# EAGLE design motor (EAGLE 4.16)
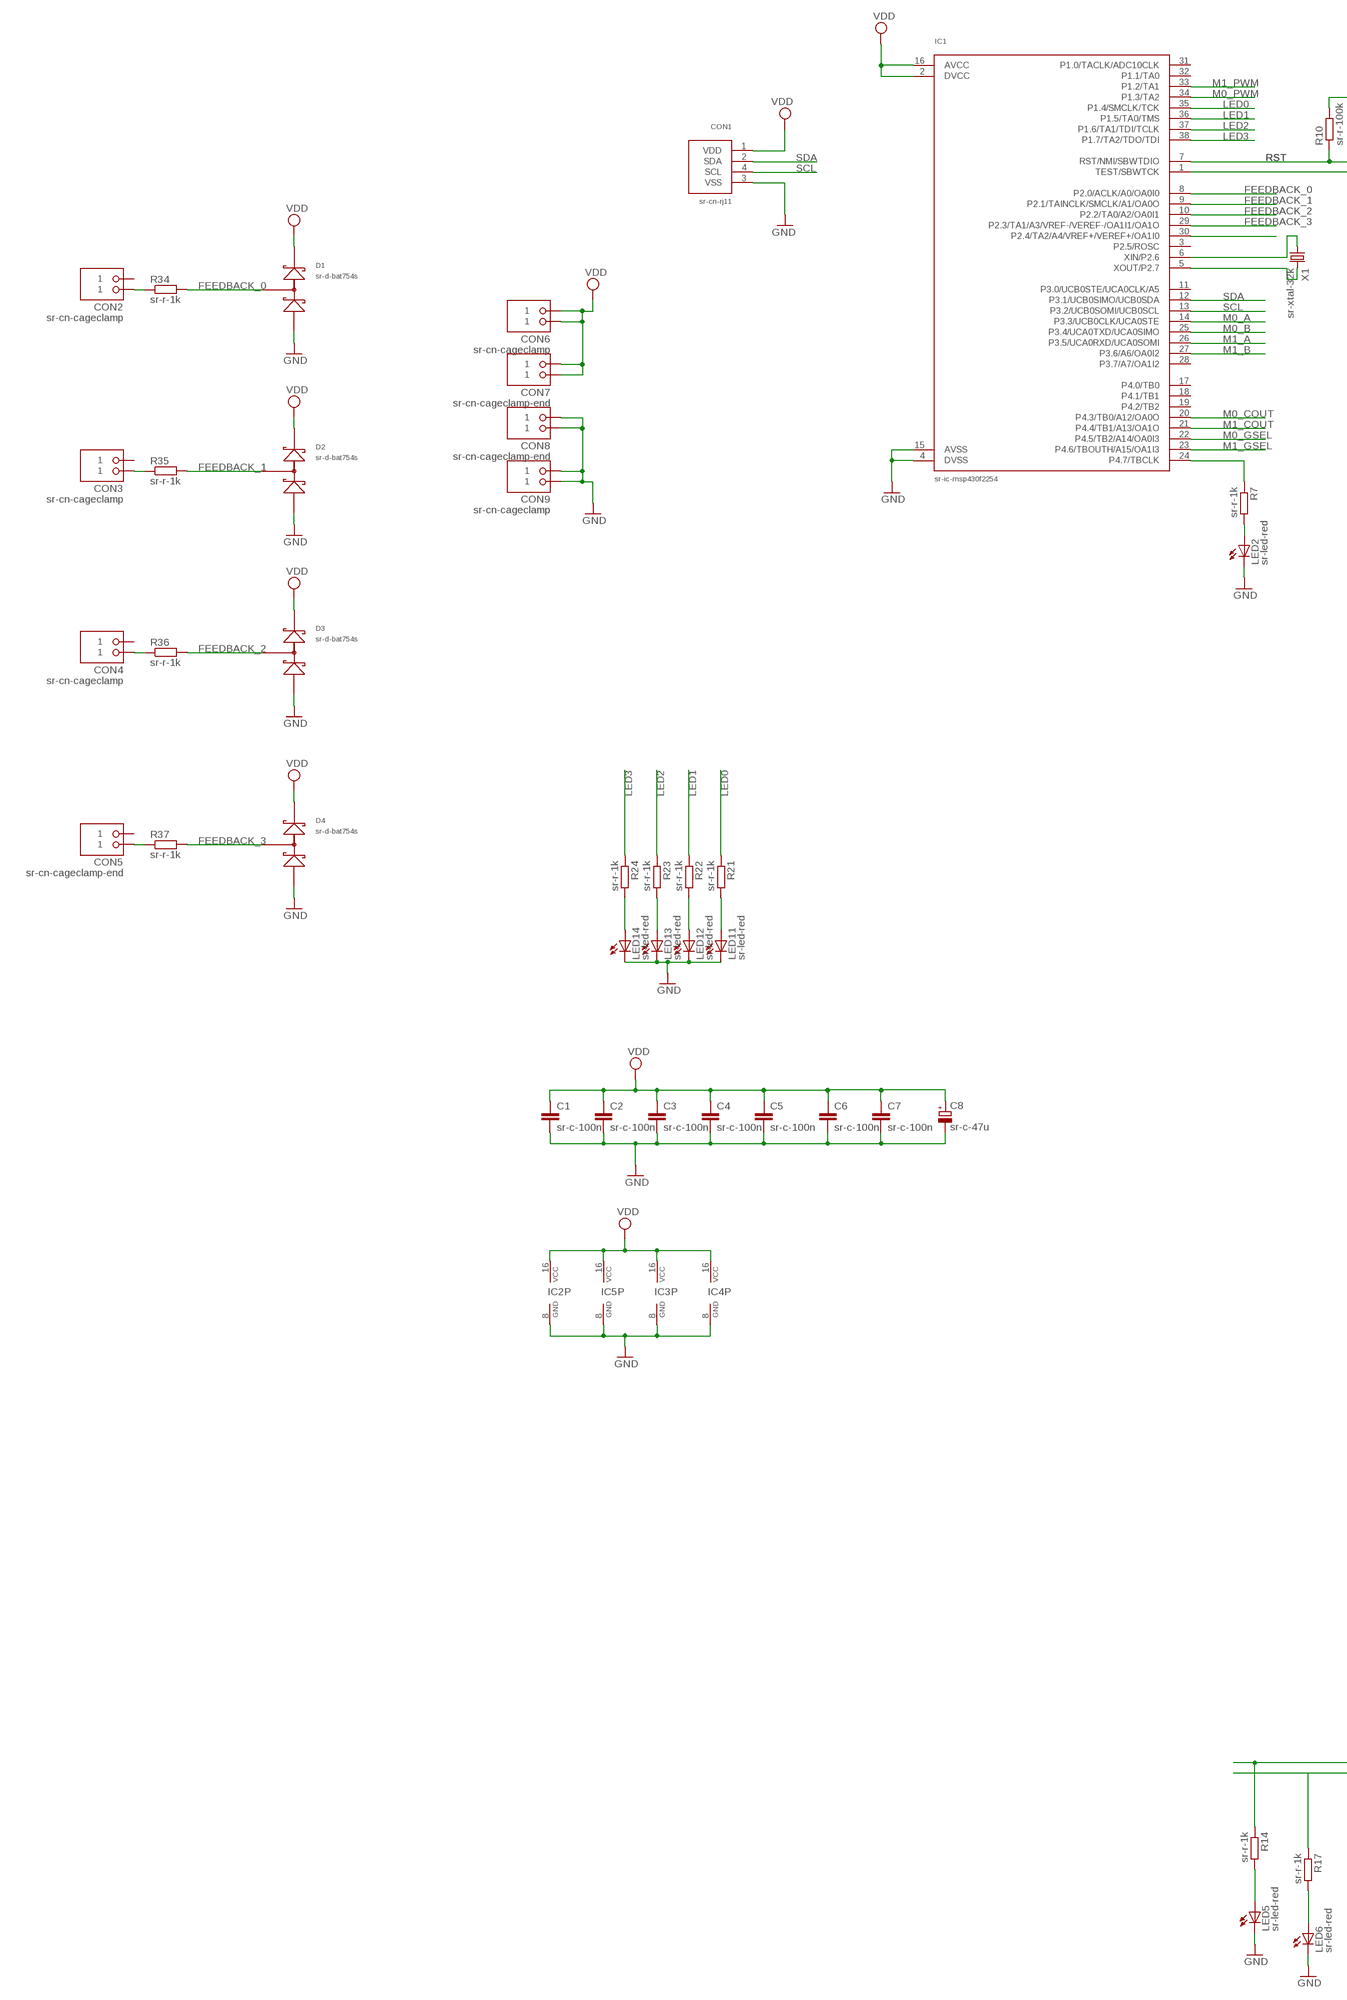
[diagram p0: schematic, sheet 1, part 1 of 2]
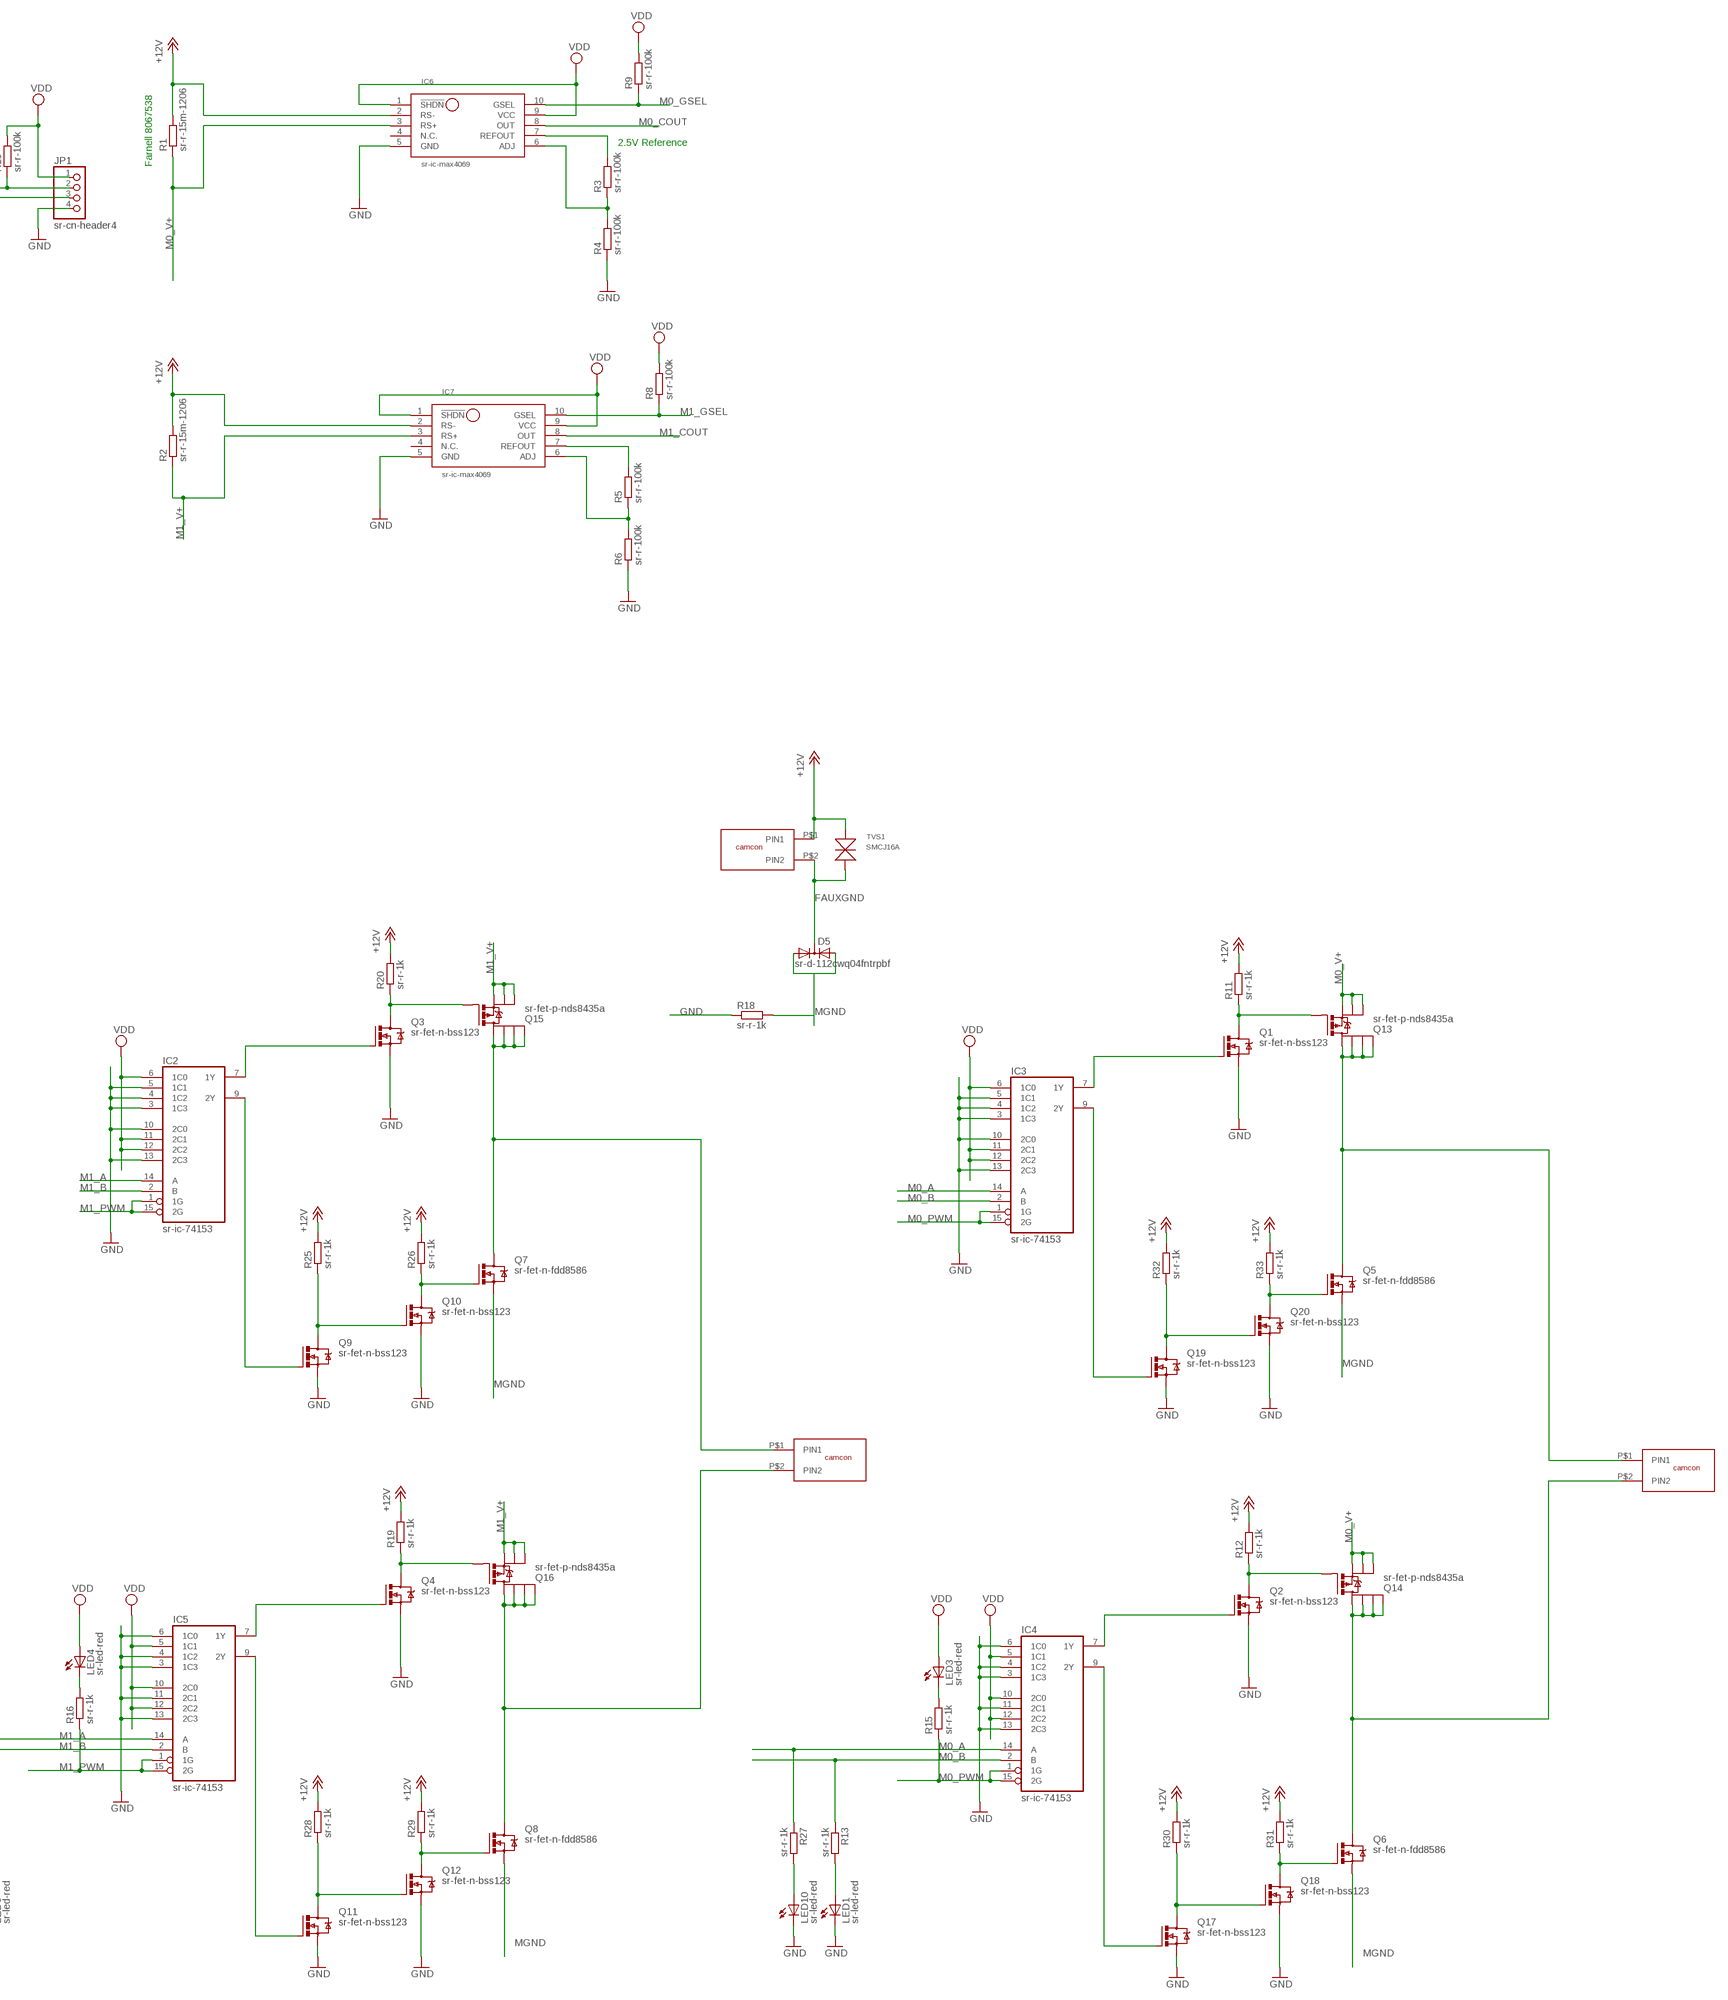
[diagram p1: schematic, sheet 1, part 2 of 2]

## Parts
C1  sr-c-100n  C-0603  [C0603]
C2  sr-c-100n  C-0603  [C0603]
C3  sr-c-100n  C-0603  [C0603]
C4  sr-c-100n  C-0603  [C0603]
C5  sr-c-100n  C-0603  [C0603]
C6  sr-c-100n  C-0603  [C0603]
C7  sr-c-100n  C-0603  [C0603]
C8  sr-c-47u  CPOL-EUE1.8-4  [E1,8-4]
CON1  sr-cn-rj11  MODULE_CON  [RJ11-4P4C]
CON2  sr-cn-cageclamp  CAGECLAMP  [CAGECLAMP]
CON3  sr-cn-cageclamp  CAGECLAMP  [CAGECLAMP]
CON4  sr-cn-cageclamp  CAGECLAMP  [CAGECLAMP]
CON5  sr-cn-cageclamp-end  CAGECLAMP  [CAGECLAMP]
CON6  sr-cn-cageclamp  CAGECLAMP  [CAGECLAMP]
CON7  sr-cn-cageclamp-end  CAGECLAMP  [CAGECLAMP]
CON8  sr-cn-cageclamp-end  CAGECLAMP  [CAGECLAMP]
CON9  sr-cn-cageclamp  CAGECLAMP  [CAGECLAMP]
D1  sr-d-bat754s  BAT754S  [SOT23]
D2  sr-d-bat754s  BAT754S  [SOT23]
D3  sr-d-bat754s  BAT754S  [SOT23]
D4  sr-d-bat754s  BAT754S  [SOT23]
D5  sr-d-112cwq04fntrpbf  FFB20UP20DN-DIODE  [TO252-3]
IC1  sr-ic-msp430f2254  MSP430F2234  [TSSOP38]
IC2  sr-ic-74153  74153NS  [SOP16]
IC3  sr-ic-74153  74153NS  [SOP16]
IC4  sr-ic-74153  74153NS  [SOP16]
IC5  sr-ic-74153  74153NS  [SOP16]
IC6  sr-ic-max4069  MAX4069  [UMAX]
IC7  sr-ic-max4069  MAX4069  [UMAX]
JP1  sr-cn-header4  PINHD-1X4  [1X04]
LED1  sr-led-red  LEDCHIP-LED0603  [CHIP-LED0603]
LED2  sr-led-red  LEDCHIP-LED0603  [CHIP-LED0603]
LED3  sr-led-red  LEDCHIP-LED0603  [CHIP-LED0603]
LED4  sr-led-red  LEDCHIP-LED0603  [CHIP-LED0603]
LED5  sr-led-red  LEDCHIP-LED0603  [CHIP-LED0603]
LED6  sr-led-red  LEDCHIP-LED0603  [CHIP-LED0603]
LED10  sr-led-red  LEDCHIP-LED0603  [CHIP-LED0603]
LED11  sr-led-red  LEDCHIP-LED0603  [CHIP-LED0603]
LED12  sr-led-red  LEDCHIP-LED0603  [CHIP-LED0603]
LED13  sr-led-red  LEDCHIP-LED0603  [CHIP-LED0603]
LED14  sr-led-red  LEDCHIP-LED0603  [CHIP-LED0603]
Q1  sr-fet-n-bss123  2N7002  [SOT23]
Q2  sr-fet-n-bss123  2N7002  [SOT23]
Q3  sr-fet-n-bss123  2N7002  [SOT23]
Q4  sr-fet-n-bss123  2N7002  [SOT23]
Q5  sr-fet-n-fdd8586  FDD8882  [TO252-3]
Q6  sr-fet-n-fdd8586  FDD8882  [TO252-3]
Q7  sr-fet-n-fdd8586  FDD8882  [TO252-3]
Q8  sr-fet-n-fdd8586  FDD8882  [TO252-3]
Q9  sr-fet-n-bss123  2N7002  [SOT23]
Q10  sr-fet-n-bss123  2N7002  [SOT23]
Q11  sr-fet-n-bss123  2N7002  [SOT23]
Q12  sr-fet-n-bss123  2N7002  [SOT23]
Q13  sr-fet-p-nds8435a  NDS8435A  [SO08]
Q14  sr-fet-p-nds8435a  NDS8435A  [SO08]
Q15  sr-fet-p-nds8435a  NDS8435A  [SO08]
Q16  sr-fet-p-nds8435a  NDS8435A  [SO08]
Q17  sr-fet-n-bss123  2N7002  [SOT23]
Q18  sr-fet-n-bss123  2N7002  [SOT23]
Q19  sr-fet-n-bss123  2N7002  [SOT23]
Q20  sr-fet-n-bss123  2N7002  [SOT23]
R1  sr-r-15m-1206  R-EU_M1206  [M1206]
R2  sr-r-15m-1206  R-EU_M1206  [M1206]
R3  sr-r-100k  R-EU_R0603  [R0603]
R4  sr-r-100k  R-EU_R0603  [R0603]
R5  sr-r-100k  R-EU_R0603  [R0603]
R6  sr-r-100k  R-EU_R0603  [R0603]
R7  sr-r-1k  R-EU_R0603  [R0603]
R8  sr-r-100k  R-EU_R0603  [R0603]
R9  sr-r-100k  R-EU_R0603  [R0603]
R10  sr-r-100k  R-EU_R0603  [R0603]
R11  sr-r-1k  R-EU_R0603  [R0603]
R12  sr-r-1k  R-EU_R0603  [R0603]
R13  sr-r-1k  R-EU_R0603  [R0603]
R14  sr-r-1k  R-EU_R0603  [R0603]
R15  sr-r-1k  R-EU_R0603  [R0603]
R16  sr-r-1k  R-EU_R0603  [R0603]
R17  sr-r-1k  R-EU_R0603  [R0603]
R18  sr-r-1k  R-EU_R0603  [R0603]
R19  sr-r-1k  R-EU_R0603  [R0603]
R20  sr-r-1k  R-EU_R0603  [R0603]
R21  sr-r-1k  R-EU_R0603  [R0603]
R22  sr-r-1k  R-EU_R0603  [R0603]
R23  sr-r-1k  R-EU_R0603  [R0603]
R24  sr-r-1k  R-EU_R0603  [R0603]
R25  sr-r-1k  R-EU_R0603  [R0603]
R26  sr-r-1k  R-EU_R0603  [R0603]
R27  sr-r-1k  R-EU_R0603  [R0603]
R28  sr-r-1k  R-EU_R0603  [R0603]
R29  sr-r-1k  R-EU_R0603  [R0603]
R30  sr-r-1k  R-EU_R0603  [R0603]
R31  sr-r-1k  R-EU_R0603  [R0603]
R32  sr-r-1k  R-EU_R0603  [R0603]
R33  sr-r-1k  R-EU_R0603  [R0603]
R34  sr-r-1k  R-EU_R0603  [R0603]
R35  sr-r-1k  R-EU_R0603  [R0603]
R36  sr-r-1k  R-EU_R0603  [R0603]
R37  sr-r-1k  R-EU_R0603  [R0603]
TVS1  SMCJ16A  [DO-214AB]
U$1  sr-cn-camcon2w  CAMCON2W  [09CON2W]
U$2  sr-cn-camcon2w  CAMCON2W  [09CON2W]
U$3  sr-cn-camcon2w  CAMCON2W  [09CON2W]
X1  sr-xtal-32k  CRYSTALTC26H  [TC26H]

## Nets
+12V: IC6.2(RS-) IC7.2(RS-) R1.2 R2.2 R11.2 R12.2 R19.2 R20.2 R25.2 R26.2 R28.2 R29.2 R30.2 R31.2 R32.2 R33.2 TVS1.1 U$3.P$1(PIN1)
FAUXGND: D5.DRAIN(C) TVS1.2 U$3.P$2(PIN2)
FEEDBACK_0: D1.3(MID) IC1.8(P2.0/ACLK/A0/OA0I0) R34.2
FEEDBACK_1: D2.3(MID) IC1.9(P2.1/TAINCLK/SMCLK/A1/OA0O) R35.2
FEEDBACK_2: D3.3(MID) IC1.10(P2.2/TA0/A2/OA0I1) R36.2
FEEDBACK_3: D4.3(MID) IC1.29(P2.3/TA1/A3/VREF-/VEREF-/OA1I1/OA1O) R37.2
GND: C1.2 C2.2 C3.2 C4.2 C5.2 C6.2 C7.2 C8.- CON1.3(VSS) CON8.1 CON8.2 CON9.1 CON9.2 D1.1(ANODE) D2.1(ANODE) D3.1(ANODE) D4.1(ANODE) IC1.4(DVSS) IC1.15(AVSS) IC2.3(1C3) IC2.4(1C2) IC2.5(1C1) IC2.8(GND) IC2.10(2C0) IC2.13(2C3) IC3.3(1C3) IC3.4(1C2) IC3.5(1C1) IC3.8(GND) IC3.10(2C0) IC3.13(2C3) IC4.3(1C3) IC4.4(1C2) IC4.6(1C0) IC4.8(GND) IC4.11(2C1) IC4.13(2C3) IC5.3(1C3) IC5.4(1C2) IC5.6(1C0) IC5.8(GND) IC5.11(2C1) IC5.13(2C3) IC6.5(GND) IC7.5(GND) JP1.4 LED1.C LED2.C LED5.C LED6.C LED10.C LED11.C LED12.C LED13.C LED14.C Q1.2(S) Q2.2(S) Q3.2(S) Q4.2(S) Q9.2(S) Q10.2(S) Q11.2(S) Q12.2(S) Q17.2(S) Q18.2(S) Q19.2(S) Q20.2(S) R4.1 R6.1 R18.1
LED0: IC1.35(P1.4/SMCLK/TCK) R21.1
LED1: IC1.36(P1.5/TA0/TMS) R22.1
LED2: IC1.37(P1.6/TA1/TDI/TCLK) R23.1
LED3: IC1.38(P1.7/TA2/TDO/TDI) R24.1
M0_A: IC1.14(P3.3/UCB0CLK/UCA0STE) IC3.14(A) IC4.14(A) R27.1
M0_B: IC1.25(P3.4/UCA0TXD/UCA0SIMO) IC3.2(B) IC4.2(B) R13.1
M0_COUT: IC1.20(P4.3/TB0/A12/OA0O) IC6.8(OUT)
M0_GSEL: IC1.22(P4.5/TB2/A14/OA0I3) IC6.10(GSEL) R9.1
M0_PWM: IC1.34(P1.3/TA2) IC3.1(1G) IC3.15(2G) IC4.1(1G) IC4.15(2G) R15.1
M0_V+: IC6.3(RS+) Q13.1(S) Q13.2(S) Q13.3(S) Q14.1(S) Q14.2(S) Q14.3(S) R1.1
M1_A: IC1.26(P3.5/UCA0RXD/UCA0SOMI) IC2.14(A) IC5.14(A) R14.1
M1_B: IC1.27(P3.6/A6/OA0I2) IC2.2(B) IC5.2(B) R17.1
M1_COUT: IC1.21(P4.4/TB1/A13/OA1O) IC7.8(OUT)
M1_GSEL: IC1.23(P4.6/TBOUTH/A15/OA1I3) IC7.10(GSEL) R8.1
M1_PWM: IC1.33(P1.2/TA1) IC2.1(1G) IC2.15(2G) IC5.1(1G) IC5.15(2G) R16.1
M1_V+: IC7.3(RS+) Q15.1(S) Q15.2(S) Q15.3(S) Q16.1(S) Q16.2(S) Q16.3(S) R2.1
MGND: D5.GATE(A1) D5.SOURCE(A2) Q5.3(S) Q6.3(S) Q7.3(S) Q8.3(S) R18.2
N$1: LED11.A R21.2
N$2: IC1.24(P4.7/TBCLK) R7.1
N$3: Q5.2(D) Q13.5(D) Q13.6(D) Q13.7(D) Q13.8(D) U$1.P$1(PIN1)
N$4: IC1.6(XIN/P2.6) X1.1
N$5: Q1.3(D) Q13.4(G) R11.1
N$6: LED2.A R7.2
N$7: LED3.C R15.2
N$8: IC3.7(1Y) Q1.1(G)
N$9: LED12.A R22.2
N$10: IC1.1(TEST/SBWTCK) JP1.3
N$11: Q8.2(D) Q16.5(D) Q16.6(D) Q16.7(D) Q16.8(D) U$2.P$2(PIN2)
N$12: Q7.2(D) Q15.5(D) Q15.6(D) Q15.7(D) Q15.8(D) U$2.P$1(PIN1)
N$13: CON4.2 R36.1
N$14: Q6.2(D) Q14.5(D) Q14.6(D) Q14.7(D) Q14.8(D) U$1.P$2(PIN2)
N$15: Q2.3(D) Q14.4(G) R12.1
N$16: LED1.A R13.2
N$17: IC4.7(1Y) Q2.1(G)
N$18: CON5.2 R37.1
N$19: IC1.5(XOUT/P2.7) X1.2
N$20: LED4.C R16.2
N$21: LED5.A R14.2
N$22: Q9.3(D) Q10.1(G) R25.1
N$23: LED13.A R23.2
N$24: LED14.A R24.2
N$25: IC6.7(REFOUT) R3.2
N$26: Q3.3(D) Q15.4(G) R20.1
N$27: CON3.2 R35.1
N$28: IC6.6(ADJ) R3.1 R4.2
N$29: IC2.7(1Y) Q3.1(G)
N$30: IC2.9(2Y) Q9.1(G)
N$31: Q7.1(G) Q10.3(D) R26.1
N$32: IC7.7(REFOUT) R5.2
N$33: IC7.6(ADJ) R5.1 R6.2
N$34: LED6.A R17.2
N$35: LED10.A R27.2
N$36: Q11.3(D) Q12.1(G) R28.1
N$37: Q4.3(D) Q16.4(G) R19.1
N$38: IC5.9(2Y) Q11.1(G)
N$39: IC5.7(1Y) Q4.1(G)
N$41: Q8.1(G) Q12.3(D) R29.1
N$42: Q17.3(D) Q18.1(G) R30.1
N$43: IC4.9(2Y) Q17.1(G)
N$44: Q6.1(G) Q18.3(D) R31.1
N$45: Q19.3(D) Q20.1(G) R32.1
N$46: IC1.30(P2.4/TA2/A4/VREF+/VEREF+/OA1I0)
N$47: IC3.9(2Y) Q19.1(G)
N$48: Q5.1(G) Q20.3(D) R33.1
N$49: CON2.2 R34.1
RST: IC1.7(RST/NMI/SBWTDIO) JP1.2 R10.1
SCL: CON1.4(SCL) IC1.13(P3.2/UCB0SOMI/UCB0SCL)
SDA: CON1.2(SDA) IC1.12(P3.1/UCB0SIMO/UCB0SDA)
VDD: C1.1 C2.1 C3.1 C4.1 C5.1 C6.1 C7.1 C8.+ CON1.1(VDD) CON6.1 CON6.2 CON7.1 CON7.2 D1.2(CATHODE) D2.2(CATHODE) D3.2(CATHODE) D4.2(CATHODE) IC1.2(DVCC) IC1.16(AVCC) IC2.6(1C0) IC2.11(2C1) IC2.12(2C2) IC2.16(VCC) IC3.6(1C0) IC3.11(2C1) IC3.12(2C2) IC3.16(VCC) IC4.5(1C1) IC4.10(2C0) IC4.12(2C2) IC4.16(VCC) IC5.5(1C1) IC5.10(2C0) IC5.12(2C2) IC5.16(VCC) IC6.1(!SHDN) IC6.9(VCC) IC7.1(!SHDN) IC7.9(VCC) JP1.1 LED3.A LED4.A R8.2 R9.2 R10.2
Unconnected: CON2.1 CON3.1 CON4.1 CON5.1 IC1.3(P2.5/ROSC) IC1.11(P3.0/UCB0STE/UCA0CLK/A5) IC1.17(P4.0/TB0) IC1.18(P4.1/TB1) IC1.19(P4.2/TB2) IC1.28(P3.7/A7/OA1I2) IC1.31(P1.0/TACLK/ADC10CLK) IC1.32(P1.1/TA0)

## Notes on the sheet
- 2.5V Reference
- Farnell 8067538

## Power pins joined to a net without a drawn wire
N.C.: IC6.4(N.C.) IC7.4(N.C.)

## Library data of the parts
C1-C7 = quantum-sensor:C: Capacitor
C8 = rcl:CPOL-EU: POLARIZED CAPACITOR, European symbol
CON1 = ecssr:MODULE_CON
CON2-CON9 = ecssr:CAGECLAMP
D1-D4 = ecssr:BAT754S
D5 = ecssr-Pwr:FFB20UP20DN-DIODE
IC1 = ecssr:MSP430F2234
IC2-IC5 = ecssr:74*153: Dual 4-line to 1-line data SELECTOR/MULTIPLEXER
IC6 IC7 = ecssr-Pwr:MAX4069
JP1 = pinhead:PINHD-1X4: PIN HEADER
LED1-LED6 LED10-LED14 = led:LED: LED OSRAM: - CHIPLED LG R971, LG N971, LY N971, LG Q971, LY Q971, LO R971, LY R971 LH N974, LH R974 LS Q976, LO Q976, LY Q976 LO Q996 - Hyper CHIPLED LW Q18S LB Q993, LB Q99A, LB R99A - SideLED LS A670, LO A670, LY A670, LG A670, LP A670 LB A673, LV A673, LT A673, LW A673 LH A674 LY A675 LS A676, LA A676, LO A676, LY A676, LW A676 LS A679, LY A679, LG A679 - Hyper Micro SIDELED® LS Y876, LA Y876, LO Y876, LY Y876 LT Y87S - SmartLED LW L88C, LW L88S LB L89C, LB L89S, LG L890 LS L89K, LO L89K, LY L89K LS L896, LA L896, LO L896, LY L896 - TOPLED LS T670, LO T670, LY T670, LG T670, LP T670 LSG T670, LSP T670, LSY T670, LOP T670, LYG T670 LG T671, LOG T671, LSG T671 LB T673, LV T673, LT T673, LW T673 LH T674 LS T676, LA T676, LO T676, LY T676, LB T676, LH T676, LSB T676, LW T676 LB T67C, LV T67C, LT T67C, LS T67K, LO T67K, LY T67K, LW E67C LS E67B, LA E67B, LO E67B, LY E67B, LB E67C, LV E67C, LT E67C LW T67C LS T679, LY T679, LG T679 LS T770, LO T770, LY T770, LG T770, LP T770 LB T773, LV T773, LT T773, LW T773 LH T774 LS E675, LA E675, LY E675, LS T675 LS T776, LA T776, LO T776, LY T776, LB T776 LHGB T686 LT T68C, LB T68C - Hyper Mini TOPLED® LB M676 - Mini TOPLED Santana® LG M470 LS M47K, LO M47K, LY M47K Source: http://www.osram.convergy.de - LUMILED® LXK2-PW12-R00, LXK2-PW12-S00, LXK2-PW14-U00, LXK2-PW14-V00 LXK2-PM12-R00, LXK2-PM12-S00, LXK2-PM14-U00 LXK2-PE12-Q00, LXK2-PE12-R00, LXK2-PE12-S00, LXK2-PE14-T00, LXK2-PE14-U00 LXK2-PB12-K00, LXK2-PB12-L00, LXK2-PB12-M00, LXK2-PB14-N00, LXK2-PB14-P00, LXK2-PB14-Q00 LXK2-PR12-L00, LXK2-PR12-M00, LXK2-PR14-Q00, LXK2-PR14-R00 LXK2-PD12-Q00, LXK2-PD12-R00, LXK2-PD12-S00 LXK2-PH12-R00, LXK2-PH12-S00 LXK2-PL12-P00, LXK2-PL12-Q00, LXK2-PL12-R00 Source: www.luxeon.com
Q1-Q4 Q9-Q12 Q17-Q20 = ecssr:2N7002
Q5-Q8 = ecssr:FDD8882
Q13-Q16 = ecssr:NDS8435A
R1-R37 = rcl:R-EU_: RESISTOR, European symbol
TVS1 = sr-tvs:SMCJ16A
U$1-U$3 = ecssr-Pwr:CAMCON2W
X1 = crystal:CRYSTAL: CRYSTAL

## Board
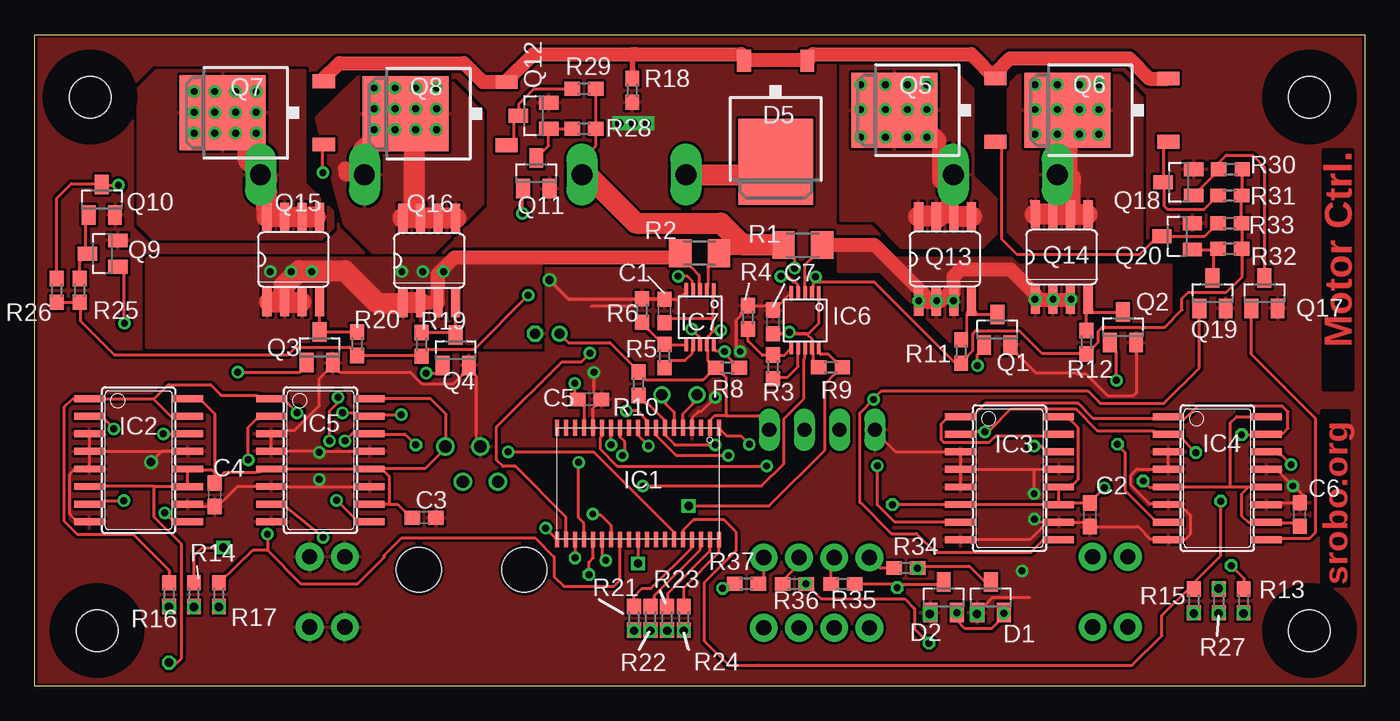
[diagram p2: board, top side]
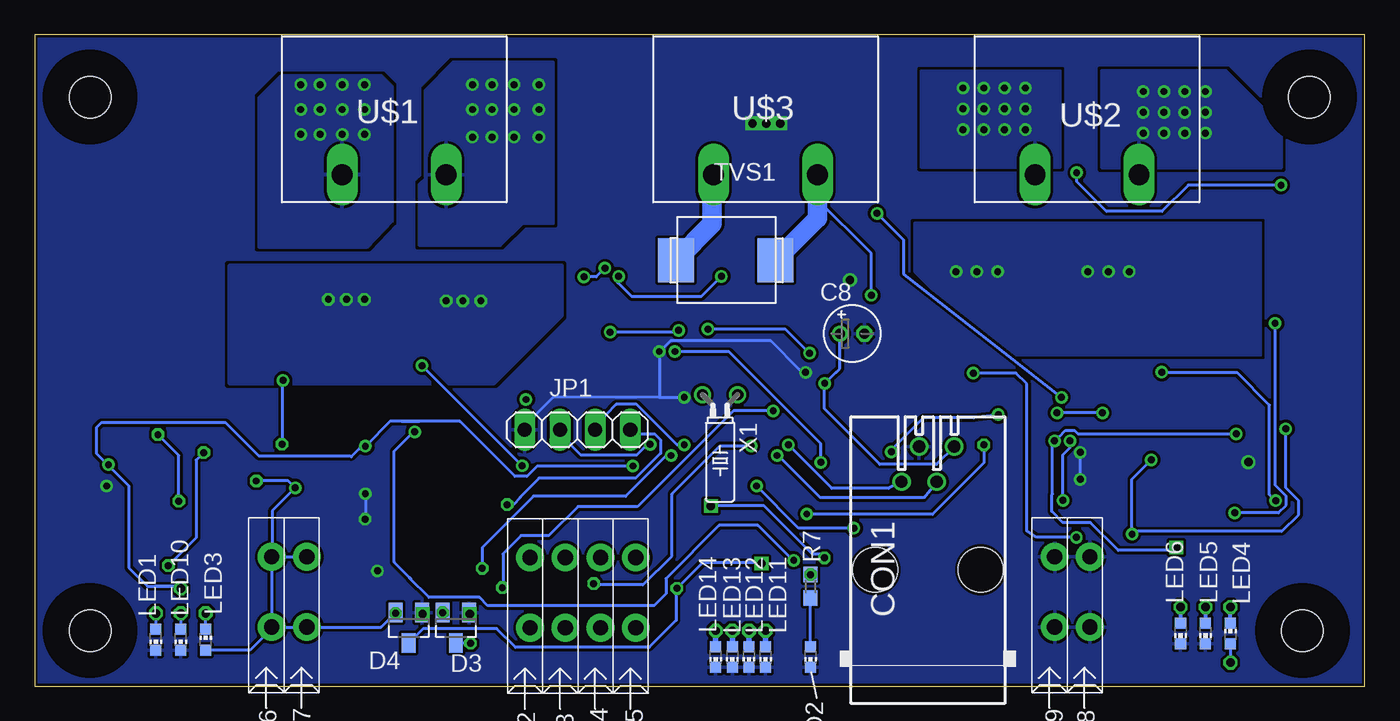
[diagram p3: board, bottom side, seen from below]

Size 96 x 47 mm. Coordinates in mm from the lower left corner, seen from the top.
Outline: 96,0 0,0 0,47 96,47 96,0
Copper layers (1*16): Top 0.035mm / dielectric 1.5mm / Bottom 0.035mm
Design rules "default": minimum track width 0.2mm, minimum drill 0.5mm, track to track 0.2mm, track to pad 0.2mm, pad to pad 0.2mm, via to via 0.2mm, smd to smd 0mil, copper to edge 0.2mm, drill to drill 0.2mm, minimum pad ring 0.2mm, minimum via ring 0.2mm, stop-mask expansion 0mil, vias tented up to drill 0mil, thermal gap 0.2mm
Holes 3 mm at 92,42.5 92,4 4,42.5 4.5,4
tRestrict: area 0.8,39.3 to 7.2,45.7; area 1.3,0.8 to 7.7,7.2; area 88.8,39.3 to 95.2,45.7; area 88.8,0.8 to 95.2,7.2
bRestrict: area 0.8,39.3 to 7.2,45.7; area 1.3,0.8 to 7.7,7.2; area 88.8,39.3 to 95.2,45.7; area 88.8,0.8 to 95.2,7.2

### Footprints (pad centres in the part's own frame; a part is rotated, then mirrored left to right if it is on the bottom)
C0603 = smd 1.1 x 1: 1 -0.85,0; 2 0.85,0
E1,8-4 = drill 0.711 pad 1.168 round: + -0.889,0 | drill 0.711 pad 1.168 octagon: - 0.889,0
RJ11-4P4C = drill 0.889 round: 1 1.905,8.89; 2 0.635,6.35; 3 -0.635,8.89; 4 -1.905,6.35 | hole 3.251: -3.81,0; 3.81,0
CAGECLAMP = drill 1.1 pad 2 round: 1 0,-0.01; 2 0,-5.08
SOT23 = smd 1 x 1.4: 1 -0.95,-1.1; 2 0.95,-1.1; 3 0,1.1
TO252-3 = smd 5.4 x 6.2: DRAIN 0.12,1.58 | smd 1 x 1.6: GATE -2.16,-5.72; SOURCE 2.4,-5.72
TSSOP38 = smd 1.15 x 0.3: 1 0,0; 2 0,-0.65; 3 0,-1.3; 4 0,-1.95; 5 0,-2.6; 6 0,-3.25; 7 0,-3.9; 8 0,-4.55; 9 0,-5.2; 10 0,-5.85; 11 0,-6.5; 12 0,-7.15; 13 0,-7.8; 14 0,-8.45; 15 0,-9.1; 16 0,-9.75; 17 0,-10.4; 18 0,-11.05; 19 0,-11.7; 20 8.05,-11.7; 21 8.05,-11.05; 22 8.05,-10.4; 23 8.05,-9.75; 24 8.05,-9.1; 25 8.05,-8.45; 26 8.05,-7.8; 27 8.05,-7.15; 28 8.05,-6.5; 29 8.05,-5.85; 30 8.05,-5.2; 31 8.05,-4.55; 32 8.05,-3.9; 33 8.05,-3.25; 34 8.05,-2.6; 35 8.05,-1.95; 36 8.05,-1.3; 37 8.05,-0.65; 38 8.05,0
SOP16 = smd 0.5 x 2.2: 1 -4.445,-3.55; 2 -3.185,-3.55; 3 -1.915,-3.55; 4 -0.645,-3.55; 5 0.635,-3.55; 6 1.895,-3.55; 7 3.165,-3.55; 8 4.435,-3.55; 9 4.445,3.55; 10 3.175,3.55; 11 1.905,3.55; 12 0.635,3.55; 13 -0.635,3.55; 14 -1.905,3.55; 15 -3.175,3.55; 16 -4.445,3.55
UMAX = smd 0.94 x 0.254: 1 -1.358,0.193; 2 -1.358,-0.307; 3 -1.358,-0.808; 4 -1.358,-1.308; 5 -1.358,-1.808; 6 2.616,-1.808; 7 2.616,-1.308; 8 2.616,-0.808; 9 2.616,-0.307; 10 2.616,0.193
1X04 = drill 1.016 long: 1 -3.81,0; 2 -1.27,0; 3 1.27,0; 4 3.81,0
CHIP-LED0603 = smd 0.8 x 0.8: A 0,-0.75; C 0,0.75
TO252-3' = smd 1 x 1.6: 1 -2.16,-5.72; 3 2.4,-5.72 | smd 5.4 x 6.2: 2 0.12,1.58
SO08 = smd 0.66 x 2.032: 1 -1.905,-3.073; 2 -0.635,-3.073; 3 0.635,-3.073; 4 1.905,-3.073; 5 1.905,3.073; 6 0.635,3.073; 7 -0.635,3.073; 8 -1.905,3.073
M1206 = smd 1.6 x 2: 1 -1.4,0; 2 1.4,0
R0603 = smd 1.1 x 1: 1 -0.85,0; 2 0.85,0
DO-214AB = smd 2.6 x 3.2: 1 -1.3,1.6; 2 5.9,1.6
09CON2W = drill 1.5 long: P$1 -3.75,0; P$2 3.75,0
TC26H = drill 0.813 round: 1 -1.27,0; 2 1.27,0

### Placement (x,y rotation side)
C1  45.45,27.07 90 top
C2  76.16,12.37 270 top
C3  28.11,12.15 0 top
C4  12.98,13.81 270 top
C5  40.05,20.68 0 top
C6  91.3,12.38 90 top
C7  53.29,26.28 90 top
C8  37,25.43 0 bottom
CON1  31.54,8.39 0 bottom
CON2  60.24,4.2 180 bottom
CON3  57.7,4.2 180 bottom
CON4  55.16,4.2 180 bottom
CON5  52.62,4.2 180 bottom
CON6  78.9,4.25 180 bottom
CON7  76.36,4.25 180 bottom
CON8  19.84,4.25 180 bottom
CON9  22.39,4.25 180 bottom
D1  69,6.4 0 top
D2  65.6,6.4 0 top
D3  65.6,4.2 180 bottom
D4  69,4.2 180 bottom
D5  53.6,39.4 180 top
IC1  49.4,18.63 270 top
IC2  7.5,16.3 270 top
IC3  70.35,15 270 top
IC4  85.35,15 270 top
IC5  20.62,16.3 270 top
IC6  56.41,27.02 270 top
IC7  48.83,27.24 270 top
JP1  56.83,18.5 180 bottom
LED1  87.25,3.35 180 bottom
LED2  40,2.1 180 bottom
LED3  83.65,3.35 0 bottom
LED4  9.7,3.8 0 bottom
LED5  11.5,3.8 180 bottom
LED6  13.3,3.8 180 bottom
LED10  85.45,3.35 180 bottom
LED11  43.25,2.1 180 bottom
LED12  44.45,2.1 180 bottom
LED13  45.65,2.1 180 bottom
LED14  46.85,2.1 180 bottom
Q1  69.47,25.73 0 top
Q2  78.54,25.89 0 top
Q3  20.57,24.44 0 top
Q4  30.38,24.23 0 top
Q5  sr-fet-n-fdd8586  [TO252-3']  63.62,41.44 90 top
Q6  sr-fet-n-fdd8586  [TO252-3']  76.1,41.44 90 top
Q7  sr-fet-n-fdd8586  [TO252-3']  15.15,41.24 90 top
Q8  sr-fet-n-fdd8586  [TO252-3']  28.34,41.18 90 top
Q9  4.9,31.2 90 top
Q10  4.85,35.1 0 top
Q11  36.2,37 0 top
Q12  36,41.15 90 top
Q13  65.7,30.81 0 top
Q14  74.12,30.96 0 top
Q15  18.67,30.78 0 top
Q16  28.48,30.7 0 top
Q17  88.75,28.35 0 top
Q18  82.55,36.35 90 top
Q19  85,28.35 0 top
Q20  82.45,32.45 90 top
R1  55.44,31.83 180 top
R2  47.99,31.23 0 top
R3  53.3,23.04 270 top
R4  51.47,26.61 270 top
R5  45.47,23.82 270 top
R6  43.84,27.09 270 top
R7  40,7.2 270 bottom
R8  50,22.97 180 top
R9  57.44,23 180 top
R10  43.59,21.82 90 top
R11  66.87,24.14 270 top
R12  75.9,24.82 270 top
R13  87.25,6.15 270 top
R14  11.5,6.6 270 top
R15  83.65,6.15 270 top
R16  9.7,6.6 270 top
R17  13.3,6.6 270 top
R18  43.13,42.98 90 top
R19  27.93,24.66 270 top
R20  23.28,24.7 270 top
R21  43.25,4.9 270 top
R22  44.45,4.9 270 top
R23  45.65,4.9 270 top
R24  46.85,4.9 270 top
R25  3.25,28.55 270 top
R26  1.6,28.55 270 top
R27  85.45,6.15 270 top
R28  39.65,40.2 0 top
R29  39.65,43.1 0 top
R30  86.3,37.3 0 top
R31  86.25,35.4 0 top
R32  86.25,31.55 0 top
R33  86.25,33.4 0 top
R34  62.88,8.52 0 top
R35  58.33,7.37 0 top
R36  54.83,7.37 0 top
R37  51.37,7.38 180 top
TVS1  sr-d-tvs-16v-smcj16a  [DO-214AB]  43.82,32.33 180 bottom
U$1  70.05,36.9 180 bottom
U$2  20.05,36.9 180 bottom
U$3  43.25,36.9 180 bottom
X1  46.53,21.02 180 bottom

### Tracks (layer width: path | path; a pad name or v marks a point on that pad's centre or on a via)
+12V  (via drill 0.5)
  Top 0.2: 56.34,29.16 56.16,28.98 56.16,28.84 IC6.2 | 56.34,29.16 60.58,29.16 66.38,23.36 R11.2 67.34,23.82 67.7,24.18 67.7,25.44 67.9,25.64 71.06,25.64 72.7,24 75.42,24 R12.2 76.75,24.82 76.75,25.6 77.05,25.9 77.3,25.9 | IC7.2 48.58,29.06 48.58,30.22 48.6,30.24 R2.2 50.18,31.84 | 53.24,31.84 R1.2 54.82,30.84 54.84,30.82 v54.84,30.16 | v35.62,28.2 31.74,24.32 28.42,24.32 R19.2 27.44,23.86 23.76,23.86 R20.2 23.28,23.92 22.75,24.45 18.85,24.45 18.3,23.9 5.75,23.9 3.3,26.35 3.3,27.7 R25.2 R26.2 | v56.36,29.52 56.36,29.24 56.34,29.16 | R30.2 87.15,35.45 R31.2 R33.2 87.1,33.3 87.15,33.25 87.15,31.5 | 87.15,31.5 R32.2 | 87.15,31.5 87.15,29.55 86,28.4 83.25,28.4 82.8,27.95 82.8,27.15 81.55,25.9 77.3,25.9 | 77.3,25.9 77.15,25.9 | U$3.P$1 39.55,36.85 39.9,37.2 39.9,38.4 40.5,39 R28.2 R29.2
  Top 1.5: 53.24,31.84 50.18,31.84 | R1.2 51.1,31.83 49.53,33.4 43.4,33.4 40,36.8 39.5,36.8 U$3.P$1
  Top 2: U$3.P$1 39.6,37.4 39.6,37.2
  Bottom 0.2: v56.36,29.52 55.48,29.52 v54.84,30.16 | v35.62,28.2 35.62,31.22 39.6,35.2 39.5,35.9 39.4,36.6 U$3.P$1
  Bottom 1.422: TVS1.1 39.5,33.75 39.5,35.9
FAUXGND
  Top 1.5: U$3.P$2 53.5,36.9 53,37.4 53,38.8 53.5,38.3 53.5,37.84 D5.DRAIN
  Top 2: D5.DRAIN 53.22,37.82 53.2,37.8 52.7,37.5
  Bottom 1.016: 47.1,36.8 U$3.P$2
  Bottom 1.422: TVS1.2 47.1,33.35 47.1,36.8
FEEDBACK_0  (via drill 0.5, 0.5 pad 0.9)
  Top 0.2: v50.06,16.64 46.3,16.64 44.82,18.12 44.82,18.61 IC1.8 | D1.3 68.6,7.5 67.45,8.65 63.86,8.65 R34.2 63.92,8.52 | 63.92,8.52 64,8.6 | v63.7,8.5 63.9,8.5 63.92,8.52
  Bottom 0.2: v50.06,16.64 50.4,16.64 53.34,13.7 53.35,13.7 60,13.7 63.7,10 v63.7,8.5
FEEDBACK_1  (via drill 0.5, 0.5 pad 0.9)
  Top 0.2: v42.7,19.86 43.5,19.86 44.2,19.16 IC1.9 | D2.3 65.45,7.35 62.3,7.35 | 62.3,7.35 59.4,7.35 59.38,7.37 R35.2 | 62.3,7.35 62.3,7.3 62.25,7.25 v62.25,7.1
  Bottom 0.2: v42.7,19.86 45.58,19.86 52.49,12.95 52.5,12.95 56.8,12.95 58.9,10.85 60.9,10.85 | 60.9,10.85 61.9,9.85 | 60.9,10.85 62.2,9.55 62.2,7.15 v62.25,7.1
FEEDBACK_2  (via drill 0.5, 0.5 pad 0.9)
  Top 0.2: IC1.10 43.54,18.1 v44.3,17.34 | v64.55,3.1 63.5,4.15 63.5,5.6 62.8,6.3 56.75,6.3 R36.2 55.7,7.4 v55.65,7.4
  Bottom 0.2: v44.3,17.34 46.54,17.34 50.02,13.87 | 50.02,13.87 50,13.85 | D3.3 65.6,3.05 65.55,3.1 v64.55,3.1 | 50.02,13.87 50.02,9.38 52.1,7.3 55.55,7.3 v55.65,7.4
FEEDBACK_3  (via drill 0.5 pad 0.9, 0.6)
  Top 0.2: IC1.29 43.55,9.35 v43.55,8.85 | R37.2 50.6,7.31 50.6,7.5 v49.65,7.05
  Bottom 0.2: 43.95,8.8 43.9,8.75 43.75,8.9 43.5,8.9 | 43.5,8.9 43.4,8.9 | 43.5,8.9 47.8,8.9 v49.65,7.05 49.6,7.05 | v43.55,8.85 43.5,8.9 | 69.05,3.1 D4.3 67.95,4.15 62.65,4.15 61.3,2.8 51.65,2.8 49.7,4.75 49.7,6.95 49.6,7.05 | 49.6,7.05 49.55,7.1
GND  (via drill 0.5, 0.5 pad 0.9, 0.6, 0.6 pad 0.9)
  Top 0.2: IC6.5 54.6,28.37 53.36,27.13 C7.2 53.29,27.01 53.24,26.96 52.74,27.46 R4.1 50.98,26.92 50.98,26.76 50.66,26.44 50.66,24.4 v50.92,24.14 | IC7.5 47.02,28.5 46.43,27.91 C1.2 45.59,27.91 | 45.59,27.91 45.61,27.89 | 45.59,27.91 45.26,28.25 45.26,28.17 45.48,27.95 R6.1 | R6.1 43.78,28 | IC4.11 89.99,13.24 90.81,13.24 C6.2 91.63,13.76 91.54,13.76 90.86,14.44 v90.81,14.44 | v90.81,14.44 90.88,14.51 | IC4.4 82.89,15.74 | IC4.3 81.81,16.68 81.81,15.88 IC4.4 | IC3.5 66.81,14.6 66.81,15.4 IC3.4 | IC3.4 66.81,15.88 66.81,16.68 IC3.3 62.13,16.91 60.6,18.45 60.63,18.48 JP1.4 | 72.13,15.64 67.89,15.64 IC3.4 | 72.13,15.64 72.81,15.64 IC3.13 | 69.94,23.94 Q1.2 70.92,23.94 72.26,22.6 75.2,22.6 75.2,22.55 75.85,22.55 77.45,20.95 79.3,20.95 79.55,21.2 79.55,24.73 Q2.2 | 72.13,15.64 v72.13,13.88 | IC2.10 12.14,12.96 C4.2 12.98,12.84 13.04,12.78 14.66,14.4 IC5.6 18.16,14.4 20.54,14.4 | 20.54,14.4 23.08,14.4 IC5.11 | IC2.4 3.96,17.18 3.96,17.98 IC2.3 | IC2.4 5.04,16.94 9.96,16.94 IC2.13 9.18,16.93 v8.4,16.16 | IC2.4 3.96,16.7 3.96,15.9 IC2.5 3.95,15.65 2.9,15.65 2.54,15.29 2.54,12.41 3.08,11.87 IC2.8 | Q3.2 21.04,22.66 | 20.54,16.94 18.16,16.94 IC5.4 17.08,17.18 17.08,17.98 IC5.3 18.16,18.46 18.76,18.46 20.54,20.24 20.54,22.19 21.52,23.17 Q3.2 | 20.54,16.94 23.08,16.94 IC5.13 | C5.2 40.44,20.2 | v40.36,22.64 40.36,21.16 C5.2 | 40.18,27.4 43.36,27.4 R6.1 | Q4.2 31.82,22.44 31.85,22.41 31.85,17.61 CON1.3 32.15,17.3 32.15,17.35 | Q4.2 31.82,23.82 | Q3.2 22,22.66 27.1,22.66 27.94,21.82 30.22,21.82 30.84,22.44 Q4.2 | 20.54,14.4 v20.54,14.92 | v20.54,16.86 20.54,16.94 | 71.8,6.4 69.15,6.4 D1.1 68.05,5.35 68,5.4 v68,5.2
  Top 0.2: D2.1 64.7,5.3 v64.6,5.2 | 72.15,10.9 72.05,10.8 | 73.1,11.85 72.15,10.9 | 73.1,11.85 73.9,11.85 IC3.10 75.78,11.82 76.1,11.5 76.11,11.52 C2.2 79.64,11.52 80.5,10.65 81.75,10.65 81.8,10.6 IC4.8 81.8,10.55 83,10.55 83.45,11 83.45,12.3 82.65,13.1 IC4.6 | IC4.6 81.75,13.1 | IC4.6 81.75,13.15 80.45,13.15 79.1,14.5 79.1,15.2 79.55,15.65 IC4.4 | IC4.4 | 72.1,12.05 v72.15,12.05 72.15,12.1 72.4,11.85 73.1,11.85 | IC3.8 71.81,10.56 72.15,10.9 | v90.81,14.44 89.65,15.6 88.8,15.6 88.83,15.63 IC4.13 | C5.2 40.9,20.65 40.3,20.05 IC1.15 | IC1.4 47.45,19.34 47.9,19.8 48.1,19.8 49.12,20.82 v49.12,20.84
  Top 0.25: C1.2 38.55,27.91 v37.16,29.3
  Bottom 0.2: 50.92,20.84 58.6,20.84 59.88,19.56 JP1.4 | 50.92,20.84 v49.12,20.84 | 50.92,20.84 v50.92,24.14 50.58,24.44 50.12,24.9 42.86,24.9 40.8,22.84 v40.36,22.64 | v20.54,14.92 v20.54,16.86 | v8.4,16.16 8.5,16.16 8.52,16.18 | D1.1 68.05,5.35 v68,5.2 | D2.1 64.65,5.25 v64.6,5.2 64.4,5.4 | v72.13,13.88 72.13,12.02 v72.15,12.04 v72.15,12.05
  other vias: 71.25,8.32 42.2,40.6 43.2,40.6 44.2,40.6
  pour Top (rank 3): -4.35,49.8 -4.1,-2.35 99,-2.2 98.95,50.1
  pour Bottom (rank 3): -8.96,51.16 -7.8,-5 100.45,-4.85 100.8,51.1
LED0
  Top 0.2: 43.55,6.05 R21.1 43.25,6.45 43.85,7.05 44.5,7.05 47.45,10 IC1.35 | IC1.35 47.45,10.9 | IC1.35
LED1
  Top 0.2: 48,10.6 48.02,10.58 IC1.36 48.05,10.62 | R22.1 44.75,6.05 44.75,6.55 48.05,9.85 48.05,10.62 | 48.05,10.62 48.05,10.65
LED2
  Top 0.2: 48.75,10.7 IC1.37 48.75,9.75 45.7,6.7 45.7,5.8 R23.1
LED3
  Top 0.2: IC1.38 49.4,10.6 IC1.38 | R24.1 46.85,7.1 49.4,9.65 49.4,10.5 49.45,10.55 49.42,10.58 IC1.38
M0_A  (via drill 0.5, 0.6)
  Top 0.2: v90.67,15.98 89.99,16.66 IC4.14 | v52.82,15.88 42.04,15.88 40.84,17.08 40.84,17.94 40.95,18.05 40.95,18.65 40.95,18.64 IC1.14 | v72.13,17.32 72.63,17.32 72.81,17.14 IC3.14 | v85.45,7.05 R27.1
  Bottom 0.2: v52.82,15.88 59.74,15.88 60.48,15.14 61.34,15.14 65.3,19.1 69.5,19.1 | 69.5,19.1 68.25,19.1 | 69.5,19.1 70.35,19.1 v72.13,17.32 72.57,17.12 73.14,16.55 73.2,16.6 79.8,16.6 82.2,19 91.2,19 91.55,18.65 91.55,16.8 90.7,15.95 | 85.55,7.2 85.45,7.2 v85.45,7.05 85.5,7.2 85.55,7.2 | 85.55,7.2 87.35,7.2 | 90.7,15.95 90.67,15.92 v90.67,15.98 90.7,15.95 | 85.55,7.2 87.85,7.2 89.2,8.55 89.2,14.45 90.7,15.95
M0_B  (via drill 0.5, 0.5 pad 0.9)
  Top 0.2: IC3.2 67.89,18.34 v68.57,18.34 69.01,18.54 70.47,20 75.13,20 76.71,18.42 80.71,18.42 IC4.2 81.81,18.2 82.45,18.2 v83.8,16.85 | IC1.25 40.95,9.36 v41.22,9.08 | 87.3,7 R13.1 87.25,7.8 v86.35,8.7
  Bottom 0.2: v41.22,9.08 41.35,9.15 43.8,11.6 46.6,11.6 50.45,7.75 50.45,6.65 51.3,5.8 63.3,5.8 63.9,6.4 67.55,6.4 68.95,7.8 68.92,7.83 | v83.8,16.85 84.35,16.3 84.35,10.7 v86.35,8.7 | 68.92,7.83 68.85,7.75 | 68.92,7.83 70.05,8.95 70.05,16.95 68.65,18.35 68.64,18.34 v68.57,18.34
M0_COUT  (via drill 0.5)
  Top 0.2: IC6.8 55.6,24.36 55.58,24.34 55.58,23.66 55.52,23.58 55.52,20.74 54.08,19.3 54.08,16.06 52.46,14.44 v43.9,14.44 | v36.88,11.4 37.56,10.72 IC1.20
  Bottom 0.2: v43.9,14.44 40.86,11.4 v36.88,11.4
M0_GSEL  (via drill 0.5 pad 0.9, 0.6)
  Top 0.2: IC6.10 56.72,23.94 57.3,23.94 57.76,23.48 R9.1 57.76,22.52 57.02,21.78 57.02,17.02 53,13 v47.2,13 | IC1.22 38.99,9.3 | 38.99,9.3 38.99,9.2 | 38.99,9.3 39,9.3 v39,9.25
  Bottom 0.2: v47.2,13 43.35,13 39.85,9.5 39.25,9.5 v39,9.25
M0_PWM  (via drill 0.5 pad 0.9)
  Top 0.2: IC3.15 72.81,18.08 69.39,18.08 68.89,17.58 65.61,17.58 65.39,17.8 65.39,18.88 65.96,19.45 IC3.1 67.89,19.68 68.61,20.4 75.31,20.4 76.41,19.3 80.71,19.3 IC4.1 82.89,19.2 82.9,19.2 83.9,20.2 90.05,20.2 90.45,19.8 90.45,18.6 90.1,18.25 89.15,18.25 | R15.1 83.65,6.95 | R15.1 83.8,7 83.85,7.05 83.55,7.35 85.6,9.4 v85.6,13.35 | 88.97,18.25 89.05,18.25 | 88.97,18.25 IC4.15 89.08,18.18 89.15,18.25 | 89.15,18.25 88.97,18.25 | v87.1,18.15 89.05,18.15 89.15,18.25 | 46.75,10.53 IC1.34 46.8,10.55 46.8,11.25 47.55,12 49.75,12 50.65,11.1 50.65,9.8 48.35,7.5 48.35,3.25 50.1,1.5 52.2,1.5 | R15.1 83.55,7 83.4,7.15 81.35,5.1 81.35,3.65 79.2,1.5 52.2,1.5 | 52.2,1.5 52.15,1.5
  Bottom 0.2: v85.6,13.35 85.6,16.65 v87.1,18.15
M0_V+  (via drill 0.5 pad 0.9)
  Top 0.2: IC6.3 55.6,28.84 55.6,30.4 56.04,30.84 R1.1
  Top 0.5: Q13.1 63.85,27.74 63.96,27.63 64.07,27.74 | 66.41,27.7 66.37,27.74 Q13.3 66.33,28.38 65.97,28.38 | 72.24,28.24 72.22,28.21 Q14.1 | Q14.2 73.56,27.89 73.6,27.93 | Q14.3 74.62,27.89 74.58,27.93 74.54,27.89
  Top 1: 64.39,27.74 Q13.2 65.33,27.74 65.97,28.38 | 64.39,27.74 64.07,27.74 | 66.33,28.38 66.33,29.59 66.81,30.06 70.42,30.06 72.24,28.24 | Q14.1 Q14.2 74.54,27.89 | 64.39,27.74 64.39,28.04 60.6,31.83 R1.1
  other vias: 63.8,27.8 65.1,27.8 66.3,27.8 72.2,27.9 73.5,27.9 74.8,27.9
  pour Top: 61,29.9 58,29.9 58,31.9 60.5,31.9 61.5,30.9 70.5,30.9 71,30.4 82,30.4 82,24.4 66.5,24.4
  pour Bottom: 58,30.3 58,26.8 62.9,21.9 81.9,21.9 81.9,30.3
M1_A  (via drill 0.5, 0.5 pad 0.9, 0.6 pad 1)
  Top 0.2: v22.4,17.7 23.08,18.38 IC5.14 24.14,18.18 | v9.28,18.2 9.96,18.2 IC2.14 | 24.14,18.18 23.94,18.18 | R14.1 11.5,9.4 12.1,10 v13.6,10 13.7,9.9 | 24.14,18.18 26.72,18.18 v27.5,17.4 | IC1.26 41.59,11.61 40.85,12.35 40.4,12.35 40.3,12.45 v40.28,12.43 v40.28,12.42
  Bottom 0.2: v9.28,18.2 20.7,18.2 20.96,18.46 21.6,18.46 22.06,18 v22.4,17.7 22.54,17.56 22.54,13.86 22.6,13.8 22.6,12.6 21.8,11.8 19.8,11.8 17.8,9.8 14,9.8 v13.6,10 | v27.5,17.4 27.5,16.1 31.2,12.4 40.26,12.4 v40.28,12.42
M1_B  (via drill 0.5)
  Top 0.2: v15.42,16.32 15.42,18.68 15.98,19.24 IC5.2 | v5.72,18.56 5.04,19.24 IC2.2 | 16.8,11 v16.8,10.96 16.8,9.8 | R17.1 15.75,9.8 16.8,9.8 | 16.8,9.8 19.2,7.4 23.3,7.4 25.25,9.35 25.25,9.4 25.2,9.4 26.5,10.7 36.1,10.7 37.5,9.3 37.5,7.9 38.2,7.2 41.8,7.2 42.27,7.67 42.25,7.7 IC1.27
  Bottom 0.2: v15.42,16.32 16.8,14.94 v16.8,10.96 16.36,11.16 6,11.16 4.78,12.38 4.78,13.38 5.72,14.32 v5.72,18.56
M1_COUT  (via drill 0.5)
  Top 0.2: v47.42,25.76 47.96,25.22 47.96,25.08 IC7.8 | 38.3,11.14 IC1.21 38.35,12.2 34.7,15.85 33.8,15.85 33.35,16.3 33.35,18.7 38.05,23.4 39.46,23.4 v40.08,24.02
  Bottom 0.2: v47.42,25.76 41.82,25.76 v40.08,24.02
M1_GSEL  (via drill 0.5)
  Top 0.2: 49.04,24.54 49.02,24.56 IC7.10 49.14,24.16 49.62,24.16 49.71,24.07 | 49.71,24.07 50.32,23.46 R8.1 | 39.5,15.9 v39.26,16.14 39.26,16.01 39.25,16 39.25,12.15 39.65,11.76 IC1.23 | v49.8,24.14 49.78,24.14 49.71,24.07
  Bottom 0.2: v39.26,16.14 39.26,17.5 45.9,24.14 v49.8,24.14
M1_PWM  (via drill 0.5)
  Top 0.2: 45.95,11.29 40.34,16.9 v34.18,16.9 | 45.95,11.29 46,11.24 | v26.46,19.58 25.26,19.58 IC5.15 23.08,19.72 v22.22,19.72 | v18.94,19.72 18.16,20.5 IC5.1 15.98,20.98 13.45,20.98 13.45,21 12.7,21.75 9.65,21.75 8.64,20.75 8.6,20.75 | 9.7,7.4 R16.1 9.7,8.36 7.1,10.96 3.06,10.96 2.14,11.88 2.14,20.14 2.75,20.75 3.9,20.75 IC2.1 8.6,20.75 | 45.95,11.29 45.95,11.3 46.15,11.11 IC1.33 | 8.6,20.75 8.6,20.7 9.82,19.48 IC2.15
  Bottom 0.2: v18.94,19.72 v22.22,19.72 | v26.46,19.58 28.23,19.35 31.85,19.35 34.3,16.9 v34.18,16.9
M1_V+  (via drill 0.5 pad 0.9)
  Top 0.2: IC7.3 47.96,29.06 47.96,29.66 47.38,30.24 R2.1
  Top 0.5: 27.77,27.7 Q16.2 27.92,27.7 | Q16.1 26.65,27.7 | 29.07,27.7 29.07,27.67 Q16.3 | Q15.2 18.03,27.71 18.02,27.7 18,27.73 | 19.2,27.71 19.2,27.7 19.2,27.71 | Q15.1 16.8,27.71 16.88,27.78 16.93,27.73
  Top 0.813: 19.2,27.71 Q15.3
  Top 1: 27.92,27.7 29.07,27.7 | Q16.3 29.11,29.75 30.31,30.94 46.27,30.94 46.59,31.26 | 46.59,31.26 46.68,31.35 | 46.59,31.26 R2.1
  Top 1.5: 26.65,27.7 27.77,27.7 | Q16.1 24.73,27.63 22.38,29.98 19.1,29.98 18,28.88 18,27.73 16.93,27.73 | 18.03,27.71 19.2,27.71
  other vias: 17,29.9 18.5,29.9 20,29.9 26.5,29.9 28,29.9 29.5,29.9
  pour Top: 8.1,30.9 36.5,30.9 36.5,24.4 8.1,24.4
  pour Bottom: 7.5,33.4 32.5,33.4 32.5,29.9 26.5,23.9 7.5,23.9
MGND
  Top 0.2: 43.4,45.6 43.39,45.59 | 69.36,44.24 69.4,44.2 69.34,44.14 Q5.3
  Top 0.406: R18.2 43.15,44.48 43.15,45.6
  Top 1: 20.8,43.78 20.87,43.71 Q7.3 20.87,43.76 20.82,43.8 21.98,44.95 30.98,44.95 32.35,43.58 32.37,43.6 34.05,43.6 | Q6.3 80.44,43.84 79,45.28 70.4,45.28 69.36,44.24 69.3,44.18 69.34,44.14 | Q5.3 67.6,45.58 67.6,45.6 56.2,45.6 55.8,45.2 | 34.05,43.6 34,43.6 36,45.6 43.15,45.6 43.4,45.6 51,45.6 51.4,45.2 | 34.05,43.6 Q8.3 | 51.4,45.2 51.32,45.12 D5.SOURCE | 55.8,45.2 55.76,45.16 D5.GATE | 51.4,45.2 55.8,45.2
N$1  (via drill 0.6 pad 1)
  Top 0.406: v43.25,4 R21.2
  Bottom 0.406: LED11.A v43.25,4
N$2  (via drill 0.5 pad 0.9)
  Top 0.2: IC1.24 40.3,9.25 40,8.95 R7.1
  Bottom 0.2: R7.1 40.05,8.05
  other vias: 40,8.05
N$3  (via drill 0.5)
  Top 0.5: 66.53,33.88 66.41,34 66.33,33.92 Q13.6 65.75,33.88 | 65.13,33.77 65.06,33.84 Q13.7 | 63.99,33.88 64.03,33.92 64.07,33.88
  Top 1: Q5.2 62.04,40.99 62,40.95 | 62,40.95 60.55,39.51 | 62,40.95 61.95,41.01 | 62,40.95 62.6,40.35 64.38,40.35 65.29,39.44 65.29,37.1 65.29,36.59 | Q13.6 65.89,33.94 | 65.24,33.88 65.75,33.88 66.95,33.88 66.95,33.77 | Q13.7 65.3,33.88 65.35,33.93 65.27,34.01
  Top 1.016: 65.75,33.88 U$1.P$1 65.3,36.41 65.3,37.1 65.29,37.1
  Top 1.5: 66.53,33.88 Q13.5 | 65.13,33.77 65.24,33.88 | 63.99,33.88 Q13.8 | Q13.7 64.07,33.88
  other vias: 59.6,43.4 59.6,41.6 59.6,39.6 61.4,43.4 61.4,41.6 61.4,39.6 63,43.4 63,41.6 63,39.6 64.4,39.6 64.4,41.6 64.4,43.4
  pour Top (rank 2): 58.2,44.8 58.2,33.6 60.6,33.6 62.53,31.67 68.39,31.67 69.36,32.64 69.36,35.15 67.72,36.79 67.72,43.06 65.91,44.87
  pour Bottom: 65.8,45 67.8,43 67.8,36.6 68.2,36.2 68.2,31.8 62.4,31.8 60.8,33.4 58.6,33.4 58.6,45
N$4
  Top 0.2: X1.1 45.54,20.38 46.16,19.76 46.16,18.61 | 46.16,18.61 46.16,18.5 | 46.16,18.61 IC1.6
N$5
  Top 0.2: R11.1 67.28,25.52 67.28,26.74 Q13.4 67.92,26.82 68.98,26.82 Q1.3
N$6
  Bottom 0.2: LED2.A R7.2
  Bottom 0.406: R7.2 40,6.3
N$7  (via drill 0.6 pad 1)
  Top 0.2: 83.65,5.35 R15.2 v83.65,5.25
  Bottom 0.2: 83.65,3.95 LED3.C v83.65,5.25
N$8  (via drill 0.5)
  Top 0.2: v68.04,23.12 68.04,23.94 Q1.1 | v60.82,15.9 60.82,13.08 62.05,11.85 66.85,11.85 66.83,11.84 IC3.7
  Bottom 0.2: v60.82,15.9 v68.04,23.12
N$9  (via drill 0.6 pad 1)
  Top 0.406: 44.45,4.1 R22.2 v44.45,4
  Bottom 0.406: LED12.A v44.45,4
N$10  (via drill 0.5)
  Top 0.2: 49.44,18.63 IC1.1 49.4,18.61 49.94,18.06 50.96,18.06 v51.58,17.44
  Bottom 0.2: v51.58,17.44 51.78,17.44 52.56,16.66 56.58,16.66 57.34,17.42 JP1.3
N$11  (via drill 0.5 pad 0.9)
  Top 0.2: Q16.6 29.44,33.78
  Top 1: 25.77,40.37 26.7,41.3 Q8.2 26.77,41.37 | 26.77,41.37 26.82,41.43 | 26.23,41.33 26.73,41.33 26.77,41.37 | Q16.7 27.52,33.78
  Top 1.016: 23.68,38.62 23.8,38.62 U$2.P$2 22.45,36.9 22.45,37.34 | 22.45,37.34 22.45,37.35 | 22.45,37.34 22.4,37.34
  Top 1.5: 26.73,41.33 27.43,41.33 27.43,34.13 27.79,33.77 Q16.7 28.16,33.78 28.8,33.78 Q16.6 | 27.52,33.78 26.9,33.78 Q16.8 | 29.44,33.78 30.06,33.78 Q16.5 | Q8.2 23.68,38.62
  other vias: 24.5,43.15 26,43.15 27.5,43.15 29,43.15 24.5,41.65 26,41.65 27.5,41.65 29,41.65 24.5,40.15 26,40.15 27.5,40.15 29,40.15
  pour Top (rank 2): 29.78,43.92 32.33,41.37 32.33,34.81 28.71,31.19 24.51,31.19 22.38,33.32 20.33,40.99 23.3,43.92
  pour Bottom: 22,44.4 22,37.4 32,37.4 32,44.4
N$12  (via drill 0.5 pad 0.9)
  Top 0.2: 19.27,33.85 19.28,33.86 Q15.6 19.62,33.86 | 20.26,33.86 Q15.5
  Top 0.5: 19.26,33.87 19.27,33.85 19.28,33.85
  Top 1: 17.08,33.86 17.72,33.86 | 18.36,33.86 18.98,33.86
  Top 1.5: 13.57,41.3 13.47,41.2 | 13.57,41.3 Q7.2 | 13.57,41.3 13.65,41.38 14.18,41.38 14.43,41.13 15.43,41.13 15.43,37.95 16.75,36.62 | 17.08,33.86 Q15.8 16.76,34.86 16.76,35.66 | 17.72,33.86 Q15.7 18.36,33.86 | 18.98,33.86 Q15.6 | 19.62,33.86 20.26,33.86
  other vias: 11.5,42.9 13,42.9 14.5,42.9 16,42.9 11.5,41.4 13,41.4 14.5,41.4 16,41.4 11.5,39.9 13,39.9 14.5,39.9 16,39.9
  pour Top (rank 2): 19.49,44.4 19.49,36.27 21.51,34.26 21.51,33.08 20.71,32.28 8.56,32.28 7.47,33.37 7.47,43.09 8.78,44.4
  pour Bottom: 19,44.4 19,37.4 6,37.4 6,40.4 10,44.4
N$13
  Top 0.2: R36.1 53.85,7.5 55.16,8.81 CON4.2
N$14  (via drill 0.5)
  Top 0.2: Q14.8 71.9,35.04 | 74.51,36.9 74.52,37.14
  Top 0.5: Q14.7 73.61,33.9 | Q14.7 | Q14.7 | Q14.6 74.68,34.03 | Q14.5 75.99,33.99 75.95,34.03 | 74.75,36.66 74.51,36.9
  Top 1.016: 74.75,36.4 74.75,36.41 U$1.P$2
  Top 1.5: Q6.2 74.5,41.55 74.45,41.6 | Q6.2 74.52,40.76 | Q14.7 Q14.8 | Q14.7 74.68,34.03 | 75.95,34.03 Q14.6 74.75,36.4 74.75,36.66 | 74.52,37.14 Q6.2
  other vias: 72.2,43.4 72.2,41.6 72.2,39.8 73.8,43.4 73.8,41.6 73.8,39.8 75.4,43.4 75.4,41.6 75.4,39.8 76.8,43.4 76.8,41.6 76.8,39.8
  pour Top (rank 2): 70.95,44.04 78.3,44.04 79.89,42.45 79.89,31.01 72,31.01 70.26,32.75 70.26,43.35
  pour Bottom (isolate 0.406): 70.2,43.2 71,44 78.2,44 79.8,42.4 79.8,31.7 72,31.7 70.2,33.6
N$15
  Top 0.2: R12.1 75.9,26.88 Q14.4 76.34,26.98 78.06,26.98 Q2.3
N$16  (via drill 0.6 pad 1)
  Top 0.2: 87.25,5.35 R13.2 v87.25,5.25
  Bottom 0.2: 87.25,3.95 LED1.A v87.25,5.25
N$17  (via drill 0.5, 0.5 pad 0.9)
  Top 0.2: v78.08,22.06 78.08,24.1 Q2.1 | 81.81,11.85 81.9,11.85 | 81.81,11.85 IC4.7 | 81.81,11.85 80.94,11.85 78.7,14.09 78.7,16.85 78.15,17.4 v78.15,17.45
  Bottom 0.2: v78.08,22.06 78.1,22.04 78.1,17.5 v78.15,17.45
N$18
  Top 0.2: R37.1 52.33,7.53 52.4,7.35 52.62,7.33 CON5.2
N$19
  Top 0.2: X1.2 47.52,20.38 46.8,19.66 IC1.5
N$20  (via drill 0.6 pad 1)
  Top 0.3: 9.7,5.8 R16.2 v9.7,5.7
  Bottom 0.3: LED4.C v9.7,5.7
N$21  (via drill 0.6 pad 1)
  Top 0.3: R14.2 v11.5,5.7
  Bottom 0.2: LED5.A 11.5,4.4
  Bottom 0.3: v11.5,5.7 LED5.A
N$22
  Top 0.2: R25.1 3.25,30.6 3.85,31.2 Q9.3 3.7,31.2 | 3.7,31.2 3.65,31.15 | Q10.1 3.9,33.9 3.7,33.7 3.7,31.2
N$23  (via drill 0.6 pad 1)
  Top 0.406: v45.65,4 R23.2
  Bottom 0.406: LED13.A v45.65,4
N$24  (via drill 0.6 pad 1)
  Top 0.406: 46.85,4.1 R24.2 v46.85,4
  Bottom 0.406: LED14.A v46.85,4
N$25
  Top 0.2: 55.1,24.22 55.09,24.21 | 55.1,24.22 IC6.7 | 55.1,24.22 55.1,23.04 54.34,22.29 53.04,22.29 | 53.04,22.29 53.14,22.18 R3.2 | 53.04,22.29 53.02,22.31
N$26
  Top 0.2: R20.1 22.8,25.56 21.06,25.56 Q3.3 20.58,26.22 20.58,26.7 Q15.4
N$27
  Top 0.2: CON3.2 57.7,9.25 57.48,9.03 R35.1
N$28
  Top 0.2: 54.58,24.39 IC6.6 54.6,24.37 54.12,23.89 R3.1 53.34,23.89 53.37,23.86 52.52,23.86 51.47,24.91 R4.2
N$29  (via drill 0.5)
  Top 0.2: v14.66,22.66 19.14,22.66 Q3.1 | v6.44,13.38 5.04,13.38 IC2.7
  Bottom 0.2: v6.44,13.38 6.88,13.82 6.88,20.28 9.2,22.6 14.7,22.6 14.7,22.62 v14.66,22.66
N$30  (via drill 0.5, 0.5 pad 0.9)
  Top 0.2: v9.4,12.5 9.96,11.94 IC2.9 | Q9.1 6,30.2 6.48,29.72 v6.48,26.18
  Bottom 0.2: v6.48,26.18 6.48,14.5 5.68,13.7 5.68,13.06 6.24,12.5 v9.4,12.5
N$31  (via drill 0.5 pad 0.9)
  Top 0.2: Q7.1 20.87,39.02 20.8,38.95 v20.8,37.05 | R26.1 1.6,35.2 2.65,36.25 4.85,36.25 4.9,36.2 Q10.3 4.9,36.15 v6.05,36.15
  Bottom 0.2: v20.8,37.05 20.8,36.4 18.65,34.25 14.65,34.25 12.75,36.15 v6.05,36.15
N$32
  Top 0.2: IC7.7 47.46,24.16 47.46,24.02 46.94,23.5 45.96,23.5 R5.2
N$33
  Top 0.2: IC7.6 46.9,24.64 45.96,24.64 R5.1 44.98,25.04 44.32,25.7 R6.2
N$34  (via drill 0.6 pad 1)
  Top 0.3: R17.2 v13.3,5.7
  Bottom 0.2: LED6.A 13.3,4.4
  Bottom 0.3: v13.3,5.7 LED6.A
N$35  (via drill 0.6 pad 1)
  Top 0.2: R27.2 v85.45,5.25
  Bottom 0.2: 85.45,3.95 LED10.A v85.45,5.25
N$36
  Top 0.2: Q11.3 37.1,39 Q12.1 38.85,40.2 | 38.85,40.2 R28.1 | 38.85,40.2 38.9,40.15
N$37
  Top 0.2: R19.1 28.42,25.52 29.9,25.52 Q4.3 30.38,26.62 Q16.4
N$38  (via drill 0.5, 0.5 pad 0.9)
  Top 0.2: v21.9,20.84 21.9,20.48 21.28,19.86 v21.28,17.7 | v21.78,13.4 23.08,12.1 IC5.9 | 34.85,35.9 Q11.1 35.25,35.85 35.2,35.8 v35.2,34.1
  Bottom 0.2: v21.9,20.84 33.28,29.72 33.28,32.18 v35.2,34.1 | v21.28,17.7 21.28,17.2 21.78,16.7 v21.78,13.4
N$39  (via drill 0.5)
  Top 0.2: v28.26,22.58 28.94,22.58 Q4.1 | v20.82,10.74 18.16,12.9 IC5.7
  Bottom 0.2: v28.26,22.58 25.18,22.58 24.4,21.8 24.4,11.2 23.7,10.75 20.8,10.75 20.76,10.64 v20.82,10.74
N$41
  Top 0.2: Q8.1 34.6,39.55 34.6,41.1 34.85,41.1 Q12.3 34.8,41.15 34.95,41.3 34.95,42 36.05,43.1 R29.1
N$42
  Top 0.2: 85.45,37.2 85.6,37.05 | 85.45,37.2 R30.1 85.45,37.35 85.25,37.55 86,38.3 87.9,38.3 88.75,37.45 Q17.3 | 83.4,35.4 Q18.1 85.45,37.2
N$43
  Top 0.2: IC4.9 89.99,10.68 92.03,10.68 92.45,11.1 92.45,19.3 90.15,21.6 | 90.15,21.6 89.6,22.15 | Q17.1 87.8,23.95 90.15,21.6
N$44
  Top 0.2: 81.85,39.1 81.9,39.15 81.82,39.23 Q6.1 81.64,39.1 81.5,39.1 81.5,36.55 Q18.3 81.35,36.3 81.5,36.3 81.5,34.65 81.75,34.4 84.4,34.4 R31.1
N$45
  Top 0.2: 85.35,31.5 85.05,31.2 85.05,29.5 Q19.3 85.05,29.4 85.1,29.4 | 85.35,31.5 R32.1 | Q20.1 85.35,31.5
N$47  (via drill 0.5)
  Top 0.2: v60.54,20.68 59.56,19.7 59.56,13.25 59.6,13.25 61.85,11 63.65,11 65,9.65 71.9,9.65 72.81,10.55 IC3.9 | 60.52,20.7 61.12,21.3 76,21.3 76.9,20.4 81.5,20.4 84.05,22.95 Q19.1
  Top 0.25: 60.54,20.54 60.5,20.5 | 60.54,20.54 v60.54,20.68 60.52,20.7 60.5,20.7 | 60.54,20.54 60.8,20.8
N$48
  Top 0.2: Q5.1 69.8,39.27 69.8,32.25 70.9,31.15 79.75,31.15 81,32.4 81.3,32.4 Q20.3 84.45,32.45 R33.1
N$49
  Top 0.2: R34.1 62,8.55 60.97,8.55 CON2.2
N.C.  (via drill 0.5)
  Top 0.2: v46.44,29.56 47.1,29.56 47.46,29.2 47.46,29.06 IC7.4 | v53.86,29.56 54.36,29.56 54.76,29.16 54.86,29.16 55.04,28.98 55.04,28.84 IC6.4
  Bottom 0.2: v46.44,29.56 47.9,28.1 52.9,28.1 53.9,29.1 53.9,29.6 v53.86,29.56
RST  (via drill 0.5)
  Top 0.2: R10.1 44.08,20.42 44.24,20.42 45.46,19.2 IC1.7 45.48,18.61 45.48,18.12 46.2,17.4 v49.12,17.4
  Bottom 0.2: v49.12,17.4 49.64,17.4 52.56,20.32 54.04,20.32 54.8,19.56 JP1.2
SCL  (via drill 0.5)
  Top 0.2: v41.6,17.4 41.6,18.06 IC1.13
  Bottom 0.2: v41.6,17.4 38.46,14.26 34.38,14.26 CON1.4
SDA  (via drill 0.5)
  Top 0.2: 42.38,16.68 v42.42,16.64 42.38,16.64 42.36,16.66 42.6,16.9 42.6,17.62 42.24,17.98 IC1.12
  Bottom 0.2: CON1.2 31.84,13.6 39.3,13.6 42.35,16.65 42.36,16.64 v42.42,16.64
VDD  (via drill 0.5, 0.5 pad 0.9, 0.6 pad 1)
  Top 0.2: 56.6,28.35 IC6.1 56.6,26.17 55.79,25.36 | 55.72,25.43 55.79,25.36 | IC6.9 | IC7.9 | 56.09,24.54 56.09,24.41 IC6.9 | IC6.9 56.1,25.05 55.79,25.36 | 86.3,14.38 87.6,14.38 | 87.6,14.38 87.81,14.38 IC4.12 | 86.3,14.38 82.89,14.38 IC4.5 80.44,14.37 v80,14.8 | IC3.11 74.99,13.22 75.67,13.22 C2.1 76.65,13.76 v77.19,14.3 77.15,14.3 | IC3.11 72.81,13.12 67.89,13.12 IC3.6 v61.91,13.11 v61.9,13.1 | IC3.11 73.91,13.34 73.91,14.12 IC3.12 74.99,14.6 75.31,14.92 75.31,18.64 74.5,19.45 IC3.16 | v38.98,21.84 38.98,21.16 C5.1 39.22,20.68 39.65,20.25 IC1.16 | 49.88,19.52 52.26,19.52 JP1.1 | R9.2 56.16,23.48 56.16,23.94 IC6.9 | IC7.9 48.58,24.16 48.58,23.5 48.62,23.46 R8.2 | 48.96,25.66 48.96,25.6 48.58,25.22 48.58,25.08 IC7.9 | 48.96,25.66 48.96,26.52 | 48.96,26.52 48.96,28.14 IC7.1 | R8.2 48.62,22.48 48.26,22.12 44.08,22.12 R10.2 43.1,23.2 41.52,24.78 38.52,24.78 37.89,25.41 C8.+ | C1.1 45.94,26.52 48.96,26.52 | v54.46,25.54 54.46,25.43 | 48.96,25.66 v49.52,25.66 | 49.88,19.52 49.88,22.28 49.68,22.48 R8.2 | 25.58,13.12 25.26,13.12 IC5.10 | C4.1 13,14.64 13,15.38 12.76,15.62 11.04,15.62 | 8.64,14.42 9.96,14.42 IC2.11 11.07,14.39 11.1,14.42 11.04,14.48 11.04,15.62 | 8.64,14.42 5.04,14.42 IC2.6 | C4.1 13.46,15.2 13.68,15.42 15.98,15.42 IC5.5 18.16,15.68 23.08,15.68 IC5.12 24.2,15.7 24.2,15.72 25.04,15.72 | 8.64,14.42 8.64,12.18 10.6,10.22 10.6,2 10.3,1.7 v9.7,1.7 | 25.04,15.72 25.04,15.68 25.58,15.14 25.58,13.12 | IC5.16 28.56,20.74 29.7,19.6 29.7,17.4 29.6,17.3 29.61,17.29 CON1.1 | IC2.12 11.01,15.66 11,15.66 11.04,15.62 | C4.1 13.02,14.7 | C4.1 12.98,15 13.02,15.04 13.02,19.63 11.9,20.75 11.1,20.75 IC2.16
  Top 0.2: 29.6,17.25 CON1.1 | CON1.1 29.64,17.3 29.65,17.3 29.65,17.13 | C3.1 27.2,12.1 26.18,13.12 25.58,13.12 | CON1.1 29.63,17.27 29.7,17.2 28.22,15.72 25.04,15.72 | IC4.16 86.75,19.45 86.3,19 86.3,14.38 | 87.6,14.38 87.6,14.35 87.1,13.85 87.1,12.3 87.58,11.82 IC4.10 88.92,11.8 91.3,11.8 C6.1 | 49.88,19.52 49.07,19.52 48.74,19.2 IC1.2 | D4.2 v69.95,5.25 69.95,5.05 69.05,4.15 67.15,4.15 66.55,4.75 D3.2
  Top 0.25: C7.1 54.46,25.43 55.72,25.43
  Bottom 0.2: v54.46,25.54 49.64,25.54 v49.52,25.66 | JP1.1 52.26,18.2 51.26,18.2 50.82,17.76 50.82,16.8 52.62,15 59.6,15 61,13.6 60.95,13.6 61.45,13.1 v61.9,13.1 | CON1.1 30.91,16 35,16 39,20 39,21.82 v38.98,21.84 38.16,22.66 38.15,22.65 37.89,22.91 C8.+ | LED4.A v9.7,1.7 | v80,14.8 77.7,14.8 v77.2,14.3 | v77.19,14.3 v77.2,14.3 | v77.2,14.3 78.85,12.65 78.85,9.75 78.8,9.7 78.9,9.6 CON6.2 78.9,9.3 | CON7.2 78.86,9.34 78.9,9.3 | 78.9,9.3 CON6.1 | CON6.1 78.81,4.26 78.8,4.25 80.45,2.6 LED3.A | D4.2 71,4.25 76.4,4.25 | CON7.1 76.38,4.25 76.4,4.25 | CON6.1 78.89,4.25 76.4,4.25 | D4.2 v69.95,5.25 69.95,5.2 | D4.2 69.95,5.45 | C8.+ | C8.+ 37.9,25.45
  other vias: 66.55,5.3

### Text on the board
Top: Motor Ctrl. | srobo.org
bPlace: U$3 | U$1 | U$2